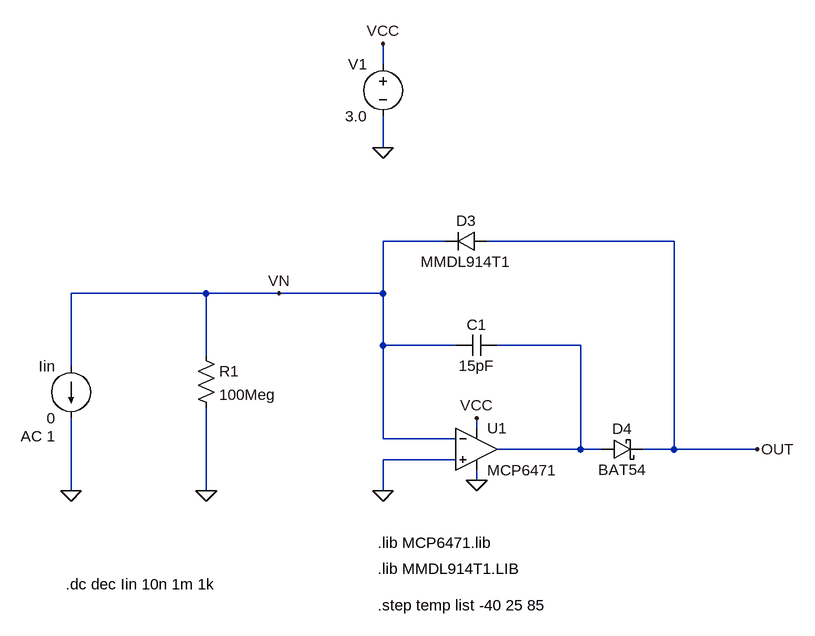
[diagram p0: schematic Log_Current_Amp_with_one_feedback_diode.asc]
Log_Current_Amp_with_one_feedback_diode.asc, the LTspice schematic file:
Version 4
SHEET 1 1236 680
WIRE -208 -480 -208 -512
WIRE -208 -352 -208 -400
WIRE -112 -208 -208 -208
WIRE 240 -208 -48 -208
WIRE -480 -128 -688 -128
WIRE -368 -128 -480 -128
WIRE -208 -128 -208 -208
WIRE -208 -128 -368 -128
WIRE -208 -48 -208 -128
WIRE -96 -48 -208 -48
WIRE 96 -48 -32 -48
WIRE -480 -32 -480 -128
WIRE -688 -16 -688 -128
WIRE -64 80 -64 64
WIRE -208 96 -208 -48
WIRE -96 96 -208 96
WIRE 96 112 96 -48
WIRE 96 112 -32 112
WIRE 128 112 96 112
WIRE 240 112 240 -208
WIRE 240 112 192 112
WIRE 368 112 240 112
WIRE -96 128 -208 128
WIRE -64 160 -64 144
WIRE -688 176 -688 64
WIRE -480 176 -480 48
WIRE -208 176 -208 128
FLAG -64 160 0
FLAG -64 64 VCC
FLAG -208 176 0
FLAG -208 -512 VCC
FLAG -208 -352 0
FLAG -480 176 0
FLAG 368 112 OUT
FLAG -368 -128 VN
FLAG -688 176 0
SYMBOL Opamps\\opamp2 -64 48 R0
SYMATTR InstName U1
SYMATTR Value MCP6471
SYMBOL diode -48 -192 M270
WINDOW 0 32 32 VTop 2
WINDOW 3 0 32 VBottom 2
SYMATTR InstName D3
SYMATTR Value MMDL914T1
SYMBOL cap -32 -64 R90
WINDOW 0 0 32 VBottom 2
WINDOW 3 32 32 VTop 2
SYMATTR InstName C1
SYMATTR Value 15pF
SYMBOL schottky 128 96 M90
WINDOW 0 0 32 VBottom 2
WINDOW 3 32 32 VTop 2
SYMATTR InstName D4
SYMATTR Value BAT54
SYMATTR Description Diode
SYMATTR Type diode
SYMBOL voltage -208 -496 M0
WINDOW 123 0 0 Left 0
WINDOW 39 0 0 Left 0
SYMATTR InstName V1
SYMATTR Value 3.0
SYMBOL res -496 -48 R0
SYMATTR InstName R1
SYMATTR Value 100Meg
SYMBOL current -688 -16 M0
WINDOW 123 24 108 Left 2
WINDOW 39 0 0 Left 0
SYMATTR Value2 AC 1
SYMATTR InstName Iin
SYMATTR Value 0
TEXT -216 256 Left 2 !.lib MCP6471.lib
TEXT -216 296 Left 2 !.lib MMDL914T1.LIB
TEXT -696 320 Left 2 !.dc dec Iin 10n 1m 1k
TEXT -216 352 Left 2 !.step temp list -40 25 85

The netlist it stands for:
* Log_Current_Amp_with_one_feedback_diode.asc
XU1 0 VN VCC 0 N001 MCP6471  ; pins In+ In- V+ V- OUT
D3 OUT VN MMDL914T1
C1 N001 VN 15pF
D4 N001 OUT BAT54
V1 VCC 0 3.0
R1 VN 0 100Meg
Iin VN 0 0 AC 1
.model D D
.lib standard.dio
.lib MCP6471.lib
.lib MMDL914T1.LIB
.dc dec Iin 10n 1m 1k
.step temp list -40 25 85
.backanno
.end

* Results of the author's LTspice run, read from the files saved beside the schematic
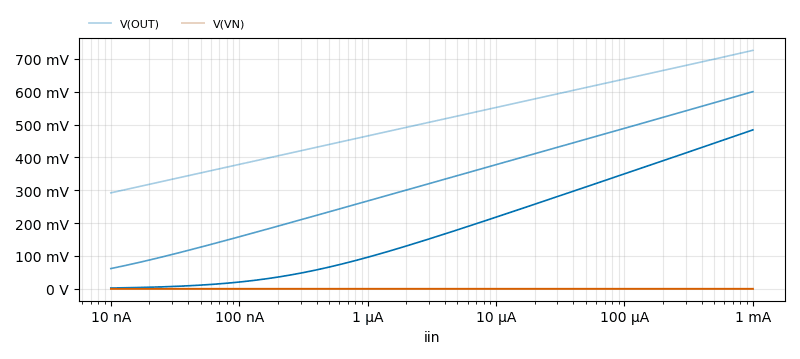
[diagram p1: DC transfer characteristic of Log_Current_Amp_with_one_feedback_diode.asc, plotted from the saved traces]
* DC transfer characteristic, 3 runs:
*   V(OUT) [temp=-40°C]: 292.2 mV at iin=10 nA, 726.2 mV at iin=1 mA, min 292.2 mV, max 726.2 mV
*   V(OUT) [temp=25°C]: 61.57 mV at iin=10 nA, 600.5 mV at iin=1 mA, min 61.57 mV, max 600.5 mV
*   V(OUT) [temp=85°C]: 2.386 mV at iin=10 nA, 484 mV at iin=1 mA, min 2.386 mV, max 484 mV
*   V(VN) [temp=-40°C]: 275.4 µV at iin=10 nA, 273.8 µV at iin=1 mA, min 273.8 µV, max 275.4 µV
*   V(VN) [temp=25°C]: 113.7 µV at iin=10 nA, 111.7 µV at iin=1 mA, min 111.7 µV, max 113.7 µV
*   V(VN) [temp=85°C]: -35.91 µV at iin=10 nA, -37.9 µV at iin=1 mA, min -37.9 µV, max -35.91 µV